# EAGLE design main (EAGLE 8.1.0)
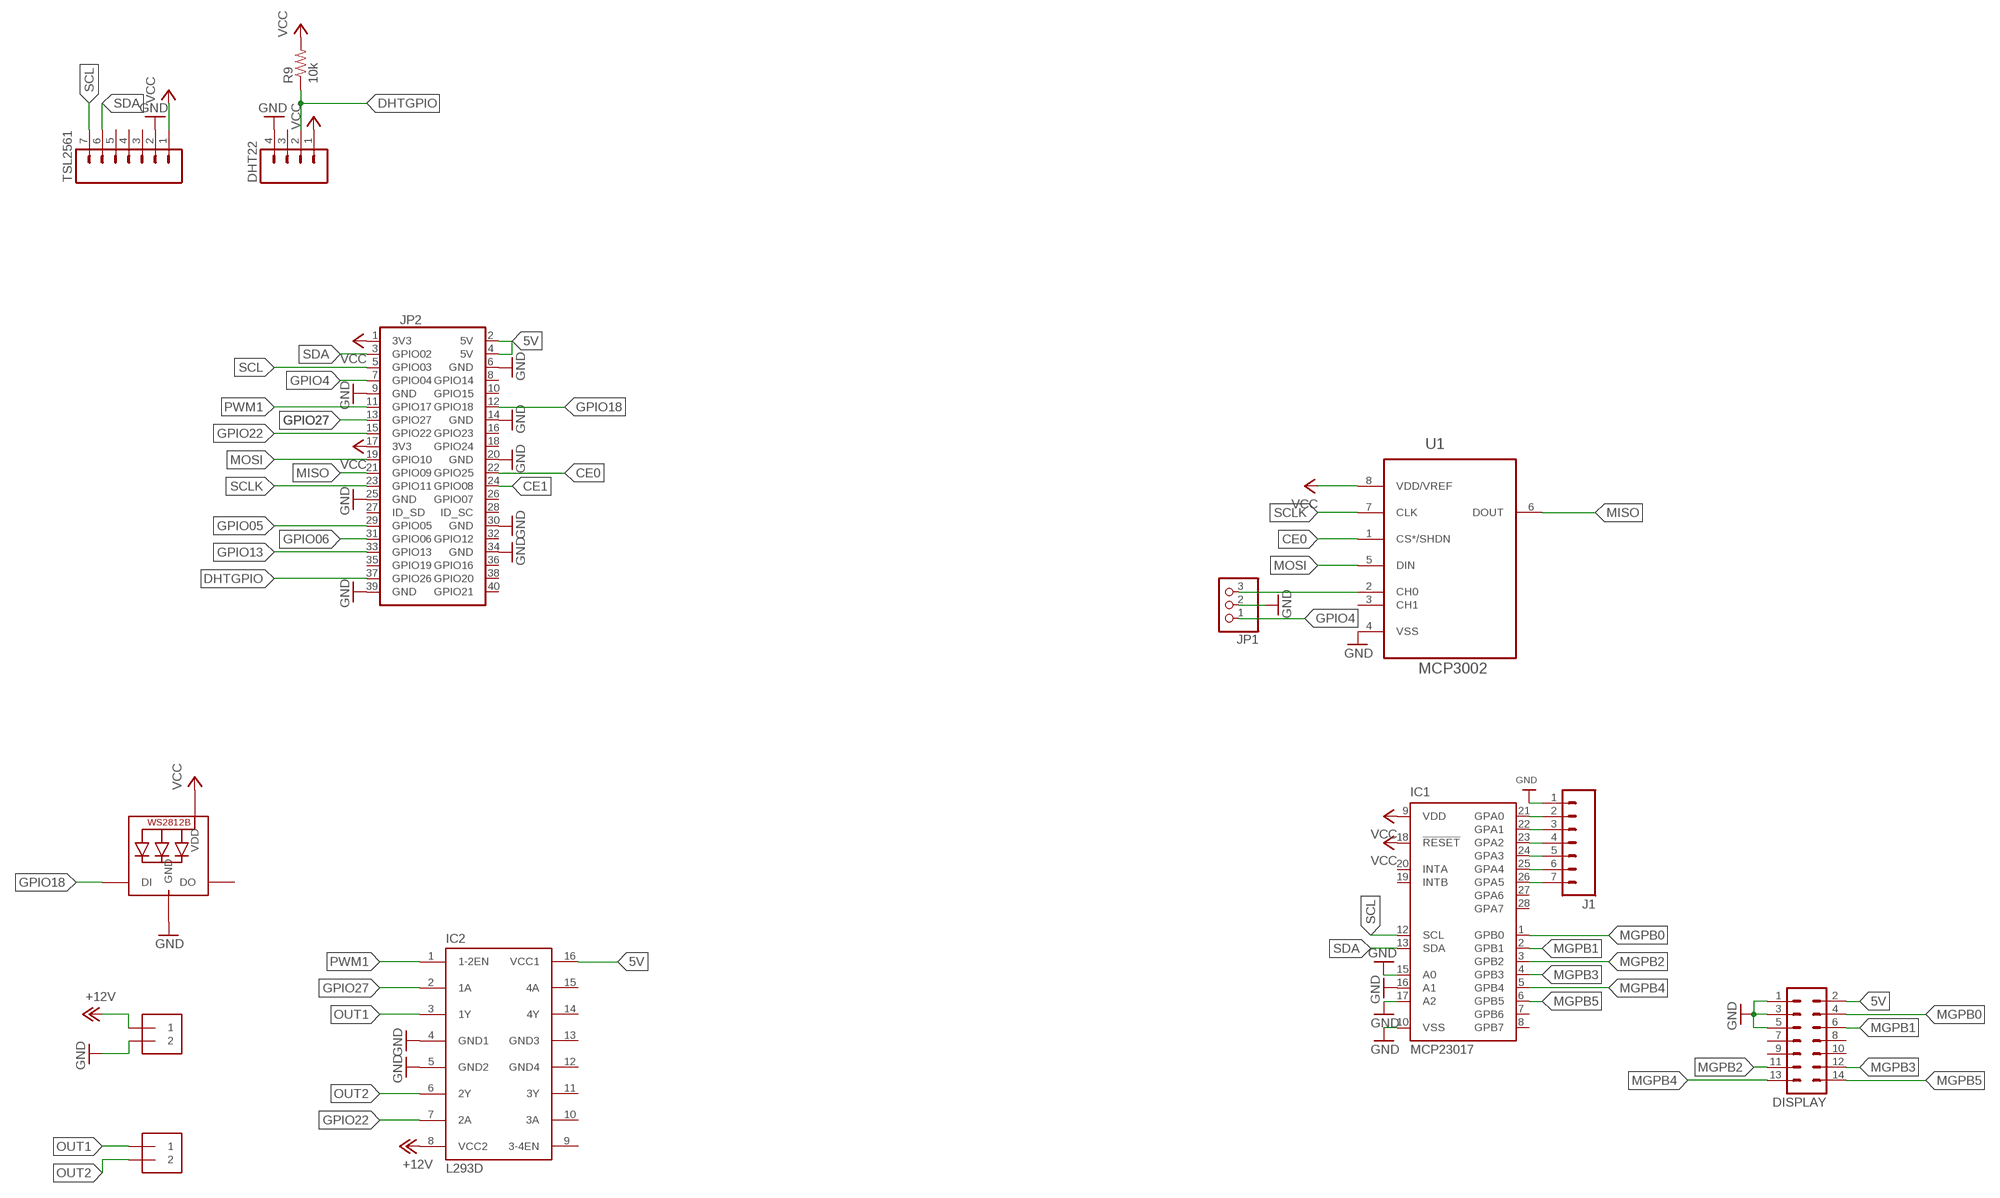
[diagram p0: schematic, sheet 1]

## Parts
DHT22  M041X04_NO_SILK  [1X04_NO_SILK]
DISPLAY  MA07-2  [MA07-2]
IC1  MCP23017  MCP23017SP2  [DIL28-3-ROUND]
IC2  L293D  [DIL16]
J1  M07  [1X07]
J2  1X2-3.5MM  [1X2-3.5MM]
J3  1X2-3.5MM  [1X2-3.5MM]
JP1  PINHD-1X3  [1X03]
JP2  40W_PI_HAT_TPH  [2X20]
LED2  WS2812BTH  [LED5MMRGB]
R9  10k  R-US_0204/7  [0204/7]
TSL2561  M07NO_SILK  [1X07_NO_SILK]
U1  MCP3002  MCP3002-I/P  [DIP254P762X533-8]

## Nets
5V: DISPLAY.2 IC2.16(VCC1) JP2.2(5V) JP2.4(5V)
+12V: IC2.8(VCC2) J2.1
CE0: JP2.22(GPIO25) U1.1(CS*/SHDN)
CE1: JP2.24(GPIO08)
DHTGPIO: DHT22.2 JP2.37(GPIO26) R9.1
GND: DHT22.4 DISPLAY.1 DISPLAY.3 DISPLAY.5 IC1.10(VSS) IC1.15(A0) IC1.16(A1) IC1.17(A2) IC2.4(GND1) IC2.5(GND2) J1.1 J2.2 JP1.2 JP2.6(GND) JP2.9(GND) JP2.14(GND) JP2.20(GND) JP2.25(GND) JP2.30(GND) JP2.34(GND) JP2.39(GND) LED2.2(GND) TSL2561.2 U1.4(VSS)
GPIO4: JP1.1 JP2.7(GPIO04)
GPIO05: JP2.29(GPIO05)
GPIO06: JP2.31(GPIO06)
GPIO13: JP2.33(GPIO13)
GPIO18: JP2.12(GPIO18) LED2.4(DI)
GPIO22: IC2.7(2A) JP2.15(GPIO22)
GPIO27: IC2.2(1A) JP2.13(GPIO27)
MGPB0: DISPLAY.4 IC1.1(GPB0)
MGPB1: DISPLAY.6 IC1.2(GPB1)
MGPB2: DISPLAY.11 IC1.3(GPB2)
MGPB3: DISPLAY.12 IC1.4(GPB3)
MGPB4: DISPLAY.13 IC1.5(GPB4)
MGPB5: DISPLAY.14 IC1.6(GPB5)
MISO: JP2.21(GPIO09) U1.6(DOUT)
MOSI: JP2.19(GPIO10) U1.5(DIN)
N$1: IC1.26(GPA5) J1.7
N$2: IC1.25(GPA4) J1.6
N$3: IC1.24(GPA3) J1.5
N$4: IC1.23(GPA2) J1.4
N$5: IC1.22(GPA1) J1.3
N$6: JP1.3 U1.2(CH0)
N$7: IC1.21(GPA0) J1.2
OUT1: IC2.3(1Y) J3.1
OUT2: IC2.6(2Y) J3.2
PWM1: IC2.1(1-2EN) JP2.11(GPIO17)
SCL: IC1.12(SCL) JP2.5(GPIO03) TSL2561.7
SCLK: JP2.23(GPIO11) U1.7(CLK)
SDA: IC1.13(SDA) JP2.3(GPIO02) TSL2561.6
VCC: DHT22.1 IC1.9(VDD) IC1.18(!RESET) JP2.1(3V3) JP2.17(3V3) LED2.3(VDD) R9.2 TSL2561.1 U1.8(VDD/VREF)
Unconnected: DHT22.3 DISPLAY.7 DISPLAY.8 DISPLAY.9 DISPLAY.10 IC1.7(GPB6) IC1.8(GPB7) IC1.19(INTB) IC1.20(INTA) IC1.27(GPA6) IC1.28(GPA7) IC2.9(3-4EN) IC2.10(3A) IC2.11(3Y) IC2.14(4Y) IC2.15(4A) JP2.8(GPIO14) JP2.10(GPIO15) JP2.16(GPIO23) JP2.18(GPIO24) JP2.26(GPIO07) JP2.27(ID_SD) JP2.28(ID_SC) JP2.32(GPIO12) JP2.35(GPIO19) JP2.36(GPIO16) JP2.38(GPIO20) JP2.40(GPIO21) LED2.1(DO) TSL2561.3 TSL2561.4 TSL2561.5 U1.3(CH1)

## Power pins joined to a net without a drawn wire
GND3: IC2.13(GND3)
GND4: IC2.12(GND4)

## Library data of the parts
DHT22 = SparkFun-Connectors:M04: Header 4 Standard 4-pin 0.1" header. Use with straight break away headers (SKU : PRT-00116), right angle break away headers (PRT-00553), swiss pins (PRT-00743), machine pins (PRT-00117), and female headers (PRT-00115). Molex polarized connector foot print use with SKU : PRT-08231 with associated crimp pins and housings. 1MM SMD Version SKU: PRT-10208; PROD_ID: CONN-09696
DISPLAY = con-lstb:MA07-2: PIN HEADER; OC_FARNELL: unknown; OC_NEWARK: unknown
IC1 = adafruit:MCP23017: http://ww1.microchip.com/downloads/en/DeviceDoc/21952a.pdf Source: http://ww1.microchip.com/downloads/en/DeviceDoc/21952a.pdf
IC2 = st-microelectronics:L293D: PUSH-PULL 4 CHANNEL DRIVER; MPN: L293D; OC_FARNELL: 9589619; OC_NEWARK: 56P8249
J1 TSL2561 = SparkFun-Connectors:M07: Header 7 Standard 7-pin 0.1" header. Use with straight break away headers (SKU : PRT-00116), right angle break away headers (PRT-00553), swiss pins (PRT-00743), machine pins (PRT-00117), and female headers (PRT-00115). NOTES ON THE VARIANTS LOCK and LOCK_LONGPADS... This footprint was designed to help hold the alignment of a through-hole component (i.e. 7-pin header) while soldering it into place. You may notice that each hole has been shifted either up or down by 0.005 of an inch from it's more standard position (which is usually a perfectly straight line). This slight alteration caused the pins (the squares in the middle) to touch the edges of the holes. Because they are alternating, it causes a "brace" to hold the header in place. 0.005 has proven to be the perfect amount of "off-center" position when using our standard breakaway headers. Although looks a little odd when you look at the bare footprint, once you have a header in there, the alteration is very hard to notice. Also, if you push a header all the way into place, it is covered up entirely on the bottom side. This idea of altering the position of holes to aid alignment will be further integrated into the Sparkfun Library for other footprints. It can help hold any component with 3 or more connection pins.
J2 J3 = adafruit:1X2: 3.5mm Terminal block http://www.ladyada.net/library/pcb/eaglelibrary.html
JP1 = adafruit:PINHD-1X3: PIN HEADER
JP2 = PiDemo_Parts:40W_PI_HAT_TPH: PIN HEADER
LED2 = adafruit:WS2812B
R9 = adafruit:R-US_: RESISTOR, American symbol
U1 = mcp:MCP3002-I/P: IC, ADC, 10BIT, 200KSPS, DIP-8; MPN: MCP3002-I/P; OC_FARNELL: 1852015; OC_NEWARK: 61K2948; PACKAGE: DIP-8; SUPPLIER: Microchip

## Board
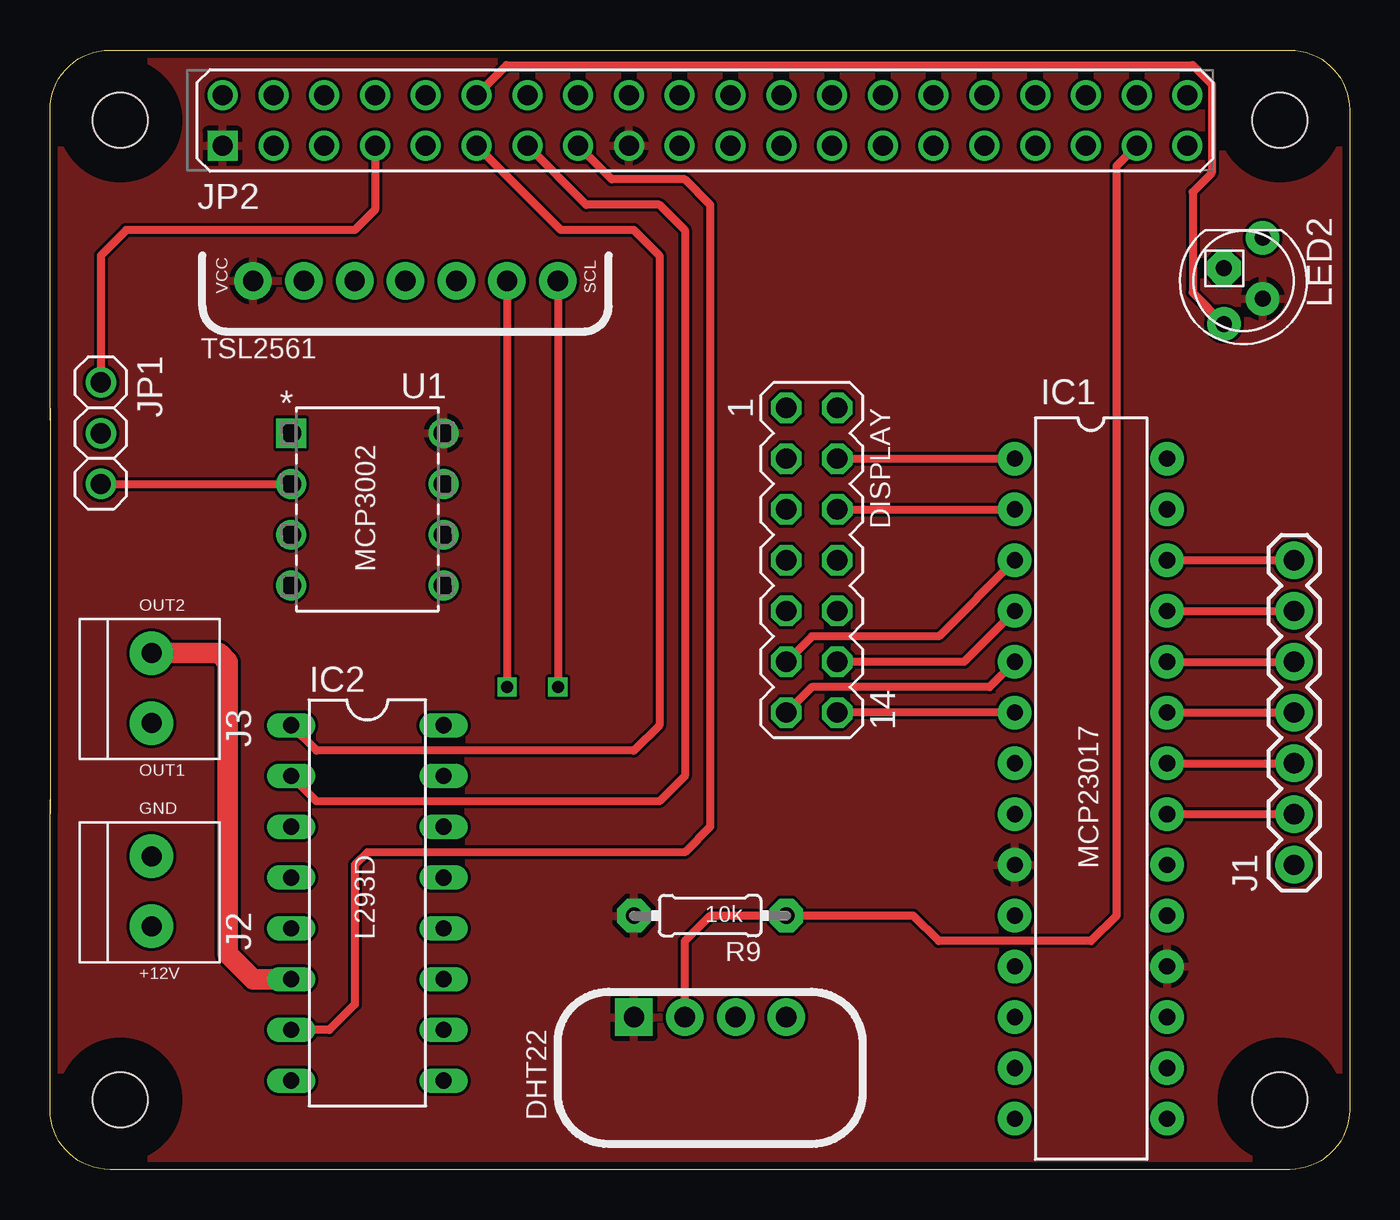
[diagram p1: board, top side]
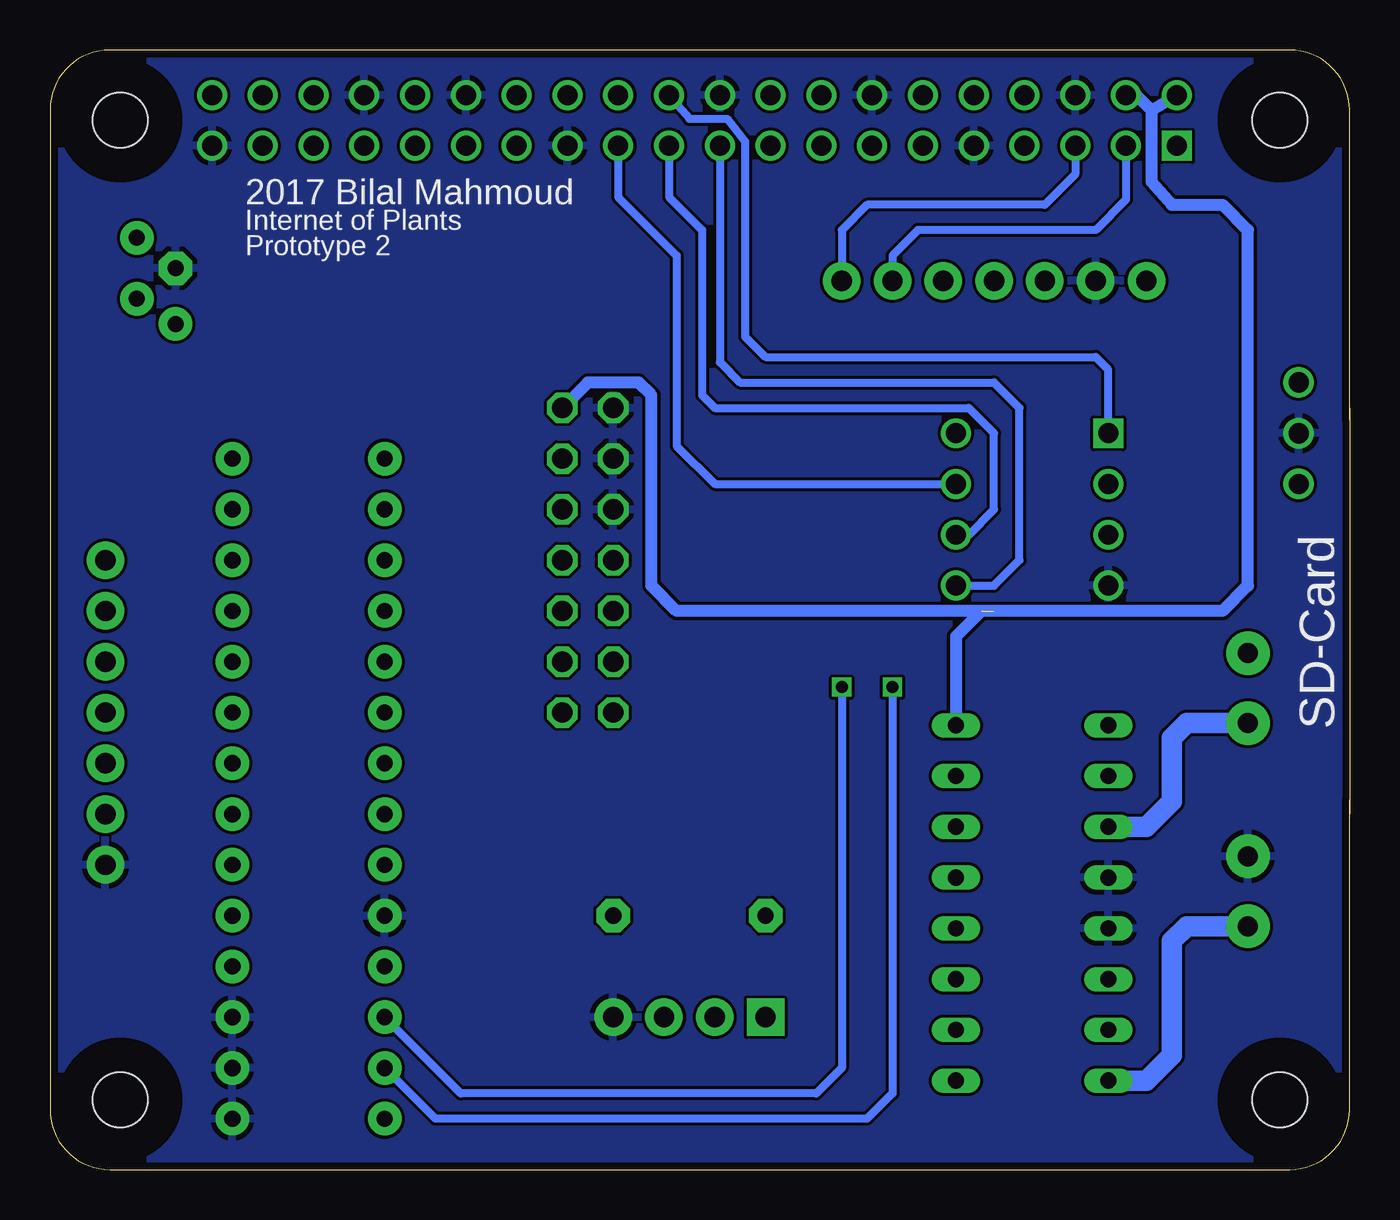
[diagram p2: board, bottom side, seen from below]

Size 65 x 56 mm. Coordinates in mm from the lower left corner, seen from the top.
Copper layers (1*16): Top 0.0356mm / dielectric 1.5011mm / Bottom 0.0356mm
Design rules "PCBs_io (1)": minimum track width 6mil, minimum drill 13mil, track to track 6mil, track to pad 6mil, pad to pad 6mil, via to via 6mil, smd to smd 6mil, copper to edge 15mil, drill to drill 6mil, minimum pad ring 7mil, minimum via ring 7mil, stop-mask expansion 3mil, vias tented up to drill 0mil, thermal gap 10mil

### Footprints (pad centres in the part's own frame; a part is rotated, then mirrored left to right if it is on the bottom)
1X04_NO_SILK = drill 1.016 pad 1.88 square: 1 0,0 | drill 1.016 pad 1.88: 2 2.54,0; 3 5.08,0; 4 7.62,0
MA07-2 = drill 1.016 octagon: 1 -7.62,-1.27; 2 -7.62,1.27; 3 -5.08,-1.27; 4 -5.08,1.27; 5 -2.54,-1.27; 6 -2.54,1.27; 7 0,-1.27; 8 0,1.27; 9 2.54,-1.27; 10 2.54,1.27; 11 5.08,-1.27; 12 5.08,1.27; 13 7.62,-1.27; 14 7.62,1.27
DIL28-3-ROUND = drill 0.813 pad 1.676: 1 -16.51,-3.81; 2 -13.97,-3.81; 3 -11.43,-3.81; 4 -8.89,-3.81; 5 -6.35,-3.81; 6 -3.81,-3.81; 7 -1.27,-3.81; 8 1.27,-3.81; 9 3.81,-3.81; 10 6.35,-3.81; 11 8.89,-3.81; 12 11.43,-3.81; 13 13.97,-3.81; 14 16.51,-3.81; 15 16.51,3.81; 16 13.97,3.81; 17 11.43,3.81; 18 8.89,3.81; 19 6.35,3.81; 20 3.81,3.81; 21 1.27,3.81; 22 -1.27,3.81; 23 -3.81,3.81; 24 -6.35,3.81; 25 -8.89,3.81; 26 -11.43,3.81; 27 -13.97,3.81; 28 -16.51,3.81
DIL16 = drill 0.813 long: 1 -8.89,-3.81; 2 -6.35,-3.81; 3 -3.81,-3.81; 4 -1.27,-3.81; 5 1.27,-3.81; 6 3.81,-3.81; 7 6.35,-3.81; 8 8.89,-3.81; 9 8.89,3.81; 10 6.35,3.81; 11 3.81,3.81; 12 1.27,3.81; 13 -1.27,3.81; 14 -3.81,3.81; 15 -6.35,3.81; 16 -8.89,3.81
1X07 = drill 1.016 pad 1.88: 1 0,0; 2 2.54,0; 3 5.08,0; 4 7.62,0; 5 10.16,0; 6 12.7,0; 7 15.24,0
1X2-3.5MM = drill 1 pad 2.184: 1 1.8,0; 2 -1.7,0
1X03 = drill 1.016: 1 -2.54,0; 2 0,0; 3 2.54,0
2X20 = drill 1 square: 1 -24.13,-1.27 | drill 1: 2 -24.13,1.27; 3 -21.59,-1.27; 4 -21.59,1.27; 5 -19.05,-1.27; 6 -19.05,1.27; 7 -16.51,-1.27; 8 -16.51,1.27; 9 -13.97,-1.27; 10 -13.97,1.27; 11 -11.43,-1.27; 12 -11.43,1.27; 13 -8.89,-1.27; 14 -8.89,1.27; 15 -6.35,-1.27; 16 -6.35,1.27; 17 -3.81,-1.27; 18 -3.81,1.27; 19 -1.27,-1.27; 20 -1.27,1.27; 21 1.27,-1.27; 22 1.27,1.27; 23 3.81,-1.27; 24 3.81,1.27; 25 6.35,-1.27; 26 6.35,1.27; 27 8.89,-1.27; 28 8.89,1.27; 29 11.43,-1.27; 30 11.43,1.27; 31 13.97,-1.27; 32 13.97,1.27; 33 16.51,-1.27; 34 16.51,1.27; 35 19.05,-1.27; 36 19.05,1.27; 37 21.59,-1.27; 38 21.59,1.27; 39 24.13,-1.27; 40 24.13,1.27
LED5MMRGB = drill 0.8 pad 1.676: 1 -2.159,0.968; 3 0.889,0.968; 4 2.159,-0.968 | drill 0.8 pad 1.676 octagon: 2 -0.635,-0.968
0204/7 = drill 0.813 pad 1.676 octagon: 1 -3.81,0; 2 3.81,0
1X07_NO_SILK = drill 1.016 pad 1.88: 1 0,0; 2 2.54,0; 3 5.08,0; 4 7.62,0; 5 10.16,0; 6 12.7,0; 7 15.24,0
DIP254P762X533-8 = drill 0.991 square: 1 -7.62,7.62 | drill 0.991: 2 -7.62,5.08; 3 -7.62,2.54; 4 -7.62,0; 5 0,0; 6 0,2.54; 7 0,5.08; 8 0,7.62
PI_HAT_STANDARD_TPH = hole 2.75: 3.5,52.5; 61.5,52.5; 3.5,3.5; 61.5,3.5

### Placement (x,y rotation side)
DHT22  29.21,7.62 0 top
DISPLAY  38.1,30.48 270 top
IC1  52.07,19.05 270 top
IC2  15.88,13.34 270 top
J1  62.23,15.24 90 top
J2  5.08,13.97 270 top
J3  5.08,24.13 270 top
JP1  2.54,36.83 270 top
JP2  32.77,52.48 0 top
LED2  59.69,44.45 270 top
R9  33.02,12.7 180 top
TSL2561  10.16,44.45 0 top
U1  19.68,29.21 0 top
U$3  [PI_HAT_STANDARD_TPH]  0,0 0 top

### Tracks (layer width: path | path; a pad name or v marks a point on that pad's centre or on a via)
5V  (1 unrouted)
  Bottom 0.61: IC2.16 19.68,26.67 18.41,27.94 6.35,27.94 5.08,29.21 5.08,46.99 6.35,48.26 8.89,48.26 9.91,49.4 9.91,52.98 | 17.78,27.94 33.66,27.94 34.92,29.21 34.92,38.73 35.56,39.37 38.1,39.37 DISPLAY.2 | 9.91,52.98 JP2.2 | JP2.4 10.67,53.75 9.91,52.98
+12V
  Bottom 1.016: J2.1 8.15,12.17 8.89,11.43 8.89,5.71 10.16,4.45 IC2.8
CE0
  Bottom 0.406: U1.1 12.06,40.01 12.7,40.64 29.21,40.64 30.23,41.66 30.23,51.44 31.11,52.55 33.02,52.55 34.04,53.72 JP2.22
DHTGPIO
  Top 0.406: DHT22.2 31.75,11.43 33.02,12.7 R9.1 43.18,12.7 44.45,11.43 52.07,11.43 53.34,12.7 53.34,50.19 JP2.37
GND
  pour Bottom: 0,55.88 0,-1.27 64.77,-1.27 64.77,55.88
GPIO4
  Top 0.406: JP1.1 2.54,45.72 3.81,46.99 15.24,46.99 16.26,48.01 JP2.7
GPIO18
  Top 0.406: JP2.12 22.84,55.24 57.15,55.24 58.1,54.29 58.1,49.85 57.15,48.9 57.15,43.86 LED2.4
GPIO22
  Top 0.406: IC2.7 13.97,6.99 15.24,8.26 15.24,15.24 15.88,15.88 31.75,15.88 33.02,17.14 33.02,48.26 31.75,49.53 28.09,49.53 JP2.15
GPIO27
  Top 0.406: IC2.2 13.34,18.41 30.48,18.41 31.75,19.68 31.75,46.99 30.48,48.26 26.82,48.26 JP2.13
MGPB0
  Top 0.406: DISPLAY.4 IC1.1
MGPB1
  Top 0.406: DISPLAY.6 IC1.2
MGPB2
  Top 0.406: IC1.3 44.45,26.67 38.1,26.67 DISPLAY.11
MGPB3
  Top 0.406: IC1.4 45.72,25.4 DISPLAY.12
MGPB4
  Top 0.406: IC1.5 46.99,24.13 38.1,24.13 DISPLAY.13
MGPB5
  Top 0.406: IC1.6 DISPLAY.14
MISO
  Bottom 0.406: U1.6 19.05,31.75 17.78,33.02 17.78,36.83 19.05,38.1 31.75,38.1 32.38,38.73 32.38,46.99 34.04,48.64 JP2.21
MOSI
  Bottom 0.406: U1.5 17.78,29.21 16.51,30.48 16.51,38.1 17.78,39.37 30.48,39.37 31.5,40.39 JP2.19
N$1
  Top 0.406: IC1.26 J1.7
N$2
  Top 0.406: IC1.25 J1.6
N$3
  Top 0.406: IC1.24 J1.5
N$4
  Top 0.406: IC1.23 J1.4
N$5
  Top 0.406: IC1.22 J1.3
N$6
  Top 0.406: JP1.3 U1.2
N$7
  Top 0.406: IC1.21 J1.2
OUT1
  Bottom 1.016: J3.1 8.15,22.33 8.89,21.59 8.89,18.41 10.16,17.14 IC2.3
OUT2
  Top 1.016: J3.2 8.46,25.83 8.89,25.4 8.89,10.79 10.16,9.53 IC2.6
PWM1
  Top 0.406: IC2.1 13.34,20.95 29.21,20.95 30.48,22.23 30.48,45.72 29.21,46.99 25.55,46.99 JP2.11
SCL  (via drill 0.6)
  Top 0.406: TSL2561.7 v25.4,24.13
  Bottom 0.406: TSL2561.7 25.4,46.99 24.13,48.26 15.24,48.26 13.72,49.78 JP2.5 | v25.4,24.13 25.4,5.08 26.67,3.81 44.45,3.81 IC1.12
SCLK
  Bottom 0.406: U1.7 31.75,34.29 33.66,36.2 33.66,45.72 36.58,48.64 JP2.23
SDA  (via drill 0.6)
  Top 0.406: TSL2561.6 v22.86,24.13
  Bottom 0.406: TSL2561.6 22.86,45.72 21.59,46.99 12.7,46.99 11.18,48.51 JP2.3 | v22.86,24.13 22.86,3.81 24.13,2.54 45.72,2.54 IC1.13
VCC
  pour Top: -1.27,55.88 64.77,55.88 64.77,0 -1.27,0

### Text on the board
tPlace: VCC | SCL
bPlace: 2017 Bilal Mahmoud | Internet of Plants | Prototype 2 | SD-Card
tNames: OUT2 | OUT1 | GND | +12V